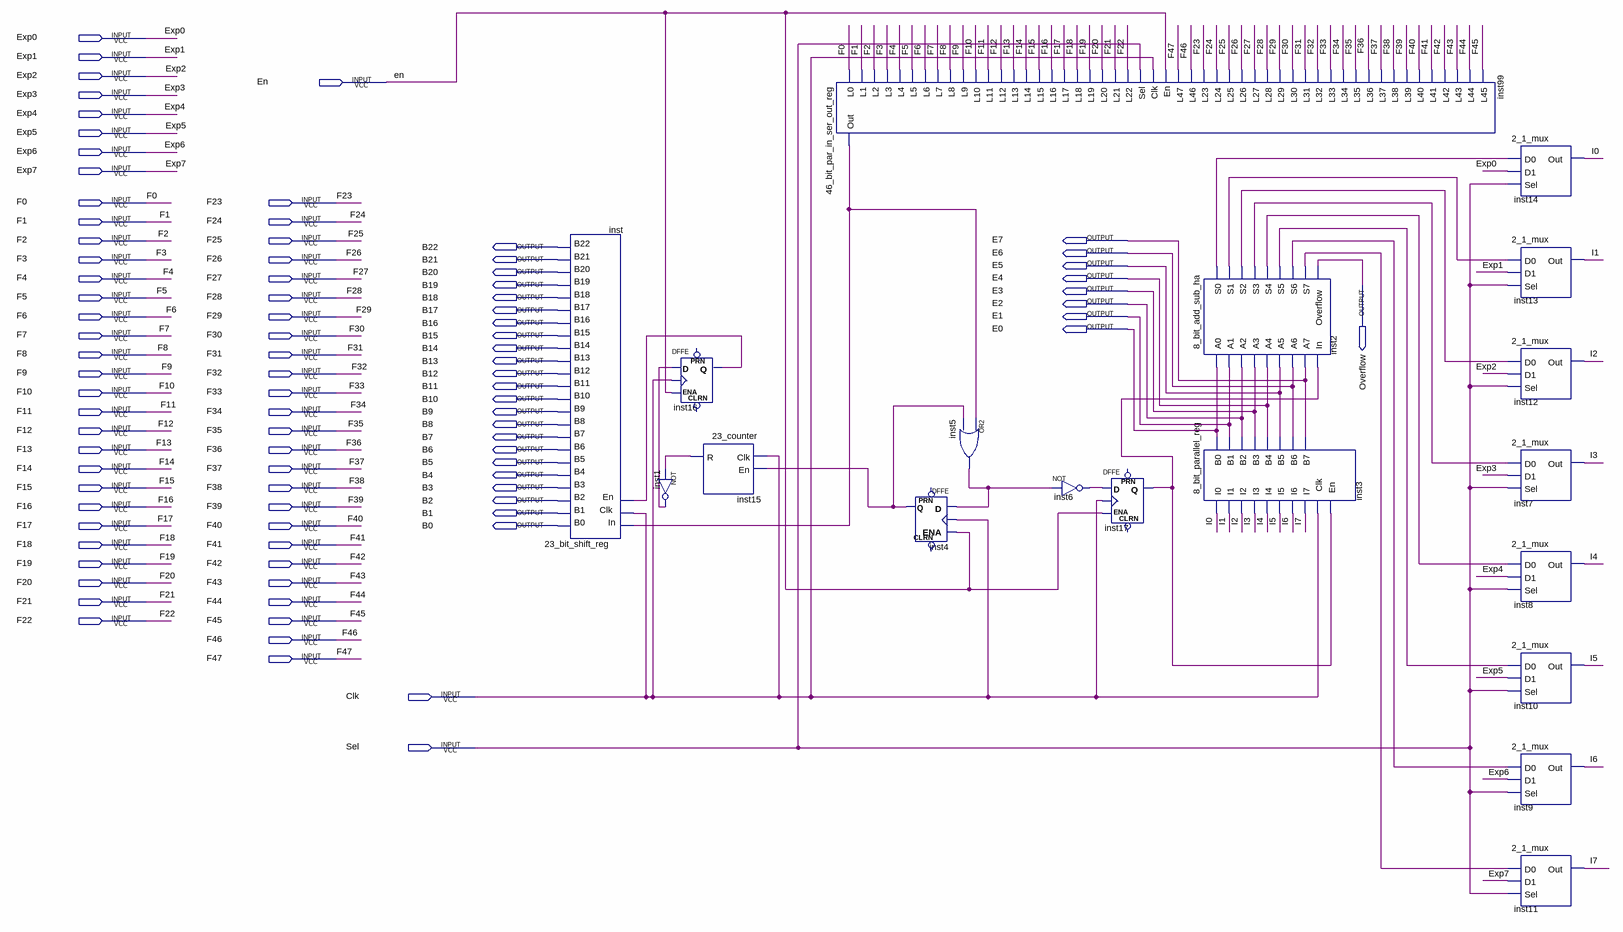
[diagram p0: schematic sheet]
// Quartus schematic Normalizer.bdf as structural Verilog: 19 symbols, 91 pins
module Normalizer (
  input  Exp0,
  input  Exp1,
  input  Exp2,
  input  En,
  input  Exp3,
  input  Exp4,
  input  Exp5,
  input  Exp6,
  input  Exp7,
  input  F0,
  input  F23,
  input  F1,
  input  F24,
  input  F2,
  input  F25,
  input  F3,
  input  F26,
  input  F4,
  input  F27,
  input  F5,
  input  F28,
  input  F6,
  input  F29,
  input  F7,
  input  F30,
  input  F8,
  input  F31,
  input  F9,
  input  F32,
  input  F10,
  input  F33,
  input  F11,
  input  F34,
  input  F12,
  input  F35,
  input  F13,
  input  F36,
  input  F14,
  input  F37,
  input  F15,
  input  F38,
  input  F16,
  input  F39,
  input  F17,
  input  F40,
  input  F18,
  input  F41,
  input  F19,
  input  F42,
  input  F20,
  input  F43,
  input  F21,
  input  F44,
  input  F22,
  input  F45,
  input  F46,
  input  F47,
  input  Clk,
  input  Sel,
  output E7,
  output B22,
  output E6,
  output B21,
  output E5,
  output B20,
  output E4,
  output B19,
  output Overflow,
  output E3,
  output B18,
  output E2,
  output B17,
  output E1,
  output B16,
  output E0,
  output B15,
  output B14,
  output B13,
  output B12,
  output B11,
  output B10,
  output B9,
  output B8,
  output B7,
  output B6,
  output B5,
  output B4,
  output B3,
  output B2,
  output B1,
  output B0
);

  wire I0, I1, I2, I3, I4, I5, I6, I7, inst1_out, inst2_s0, inst2_s1, inst2_s2, inst2_s3, inst2_s4, inst2_s5,
       inst2_s6, inst2_s7, inst4_q, inst5_out, inst6_out, inst15_r, inst16_q, inst17_q, inst99_out;

  \23_bit_shift_reg  inst (
    .In(inst99_out), .Clk(Clk), .En(inst16_q), .B0(B0), .B1(B1), .B2(B2), .B3(B3), .B4(B4), .B5(B5), .B6(B6),
    .B7(B7), .B8(B8), .B9(B9), .B10(B10), .B11(B11), .B12(B12), .B13(B13), .B14(B14), .B15(B15), .B16(B16),
    .B17(B17), .B18(B18), .B19(B19), .B20(B20), .B21(B21), .B22(B22));
  not inst1 (inst1_out, inst15_r);
  DFFE inst16 (.D(inst1_out), .CLK(Clk), .ENA(En), .Q(inst16_q));  // open: PRN, CLRN
  \23_counter  inst15 (.Clk(Clk), .En(inst4_q), .R(inst15_r));
  \46_bit_par_in_ser_out_reg  inst99 (
    .L0(F0), .L1(F1), .L2(F2), .L3(F3), .L4(F4), .L5(F5), .L6(F6), .L7(F7), .L8(F8), .L9(F9), .L10(F10),
    .L11(F11), .L12(F12), .L13(F13), .L14(F14), .L15(F15), .L16(F16), .L17(F17), .L18(F18), .L19(F19),
    .L20(F20), .L21(F21), .L22(F22), .Sel(Sel), .Clk(Clk), .En(En), .L47(F47), .L46(F46), .L23(F23),
    .L24(F24), .L25(F25), .L26(F26), .L27(F27), .L28(F28), .L29(F29), .L30(F30), .L31(F31), .L32(F32),
    .L33(F33), .L34(F34), .L35(F35), .L36(F36), .L37(F37), .L38(F38), .L39(F39), .L40(F40), .L41(F41),
    .L42(F42), .L43(F43), .L44(F44), .L45(F45), .Out(inst99_out));
  DFFE inst4 (.D(inst5_out), .CLK(Clk), .ENA(En), .Q(inst4_q));  // open: PRN, CLRN
  or inst5 (inst5_out, inst99_out, inst4_q);
  not inst6 (inst6_out, inst5_out);
  DFFE inst17 (.D(inst6_out), .CLK(Clk), .ENA(En), .Q(inst17_q));  // open: PRN, CLRN
  \8_bit_add_sub_ha  inst2 (
    .A0(E0), .A1(E1), .A2(E2), .A3(E3), .A4(E4), .A5(E5), .A6(E6), .A7(E7), .In(inst17_q), .S0(inst2_s0),
    .S1(inst2_s1), .S2(inst2_s2), .S3(inst2_s3), .S4(inst2_s4), .S5(inst2_s5), .S6(inst2_s6), .S7(inst2_s7),
    .Overflow(Overflow));
  \8_bit_parallel_reg  inst3 (
    .I0(I0), .I1(I1), .I2(I2), .I3(I3), .I4(I4), .I5(I5), .I6(I6), .I7(I7), .Clk(Clk), .En(inst17_q),
    .B0(E0), .B1(E1), .B2(E2), .B3(E3), .B4(E4), .B5(E5), .B6(E6), .B7(E7));
  \2_1_mux  inst14 (.D0(inst2_s0), .D1(Exp0), .Sel(Sel), .Out(I0));
  \2_1_mux  inst13 (.D0(inst2_s1), .D1(Exp1), .Sel(Sel), .Out(I1));
  \2_1_mux  inst12 (.D0(inst2_s2), .D1(Exp2), .Sel(Sel), .Out(I2));
  \2_1_mux  inst7 (.D0(inst2_s3), .D1(Exp3), .Sel(Sel), .Out(I3));
  \2_1_mux  inst8 (.D0(inst2_s4), .D1(Exp4), .Sel(Sel), .Out(I4));
  \2_1_mux  inst10 (.D0(inst2_s5), .D1(Exp5), .Sel(Sel), .Out(I5));
  \2_1_mux  inst9 (.D0(inst2_s6), .D1(Exp6), .Sel(Sel), .Out(I6));
  \2_1_mux  inst11 (.D0(inst2_s7), .D1(Exp7), .Sel(Sel), .Out(I7));
endmodule
